# Altium schematic sheet Rotary_Encoder_Breakout_Sch.SchDoc
size A; SheetNumber: 1; SheetTotal: 1
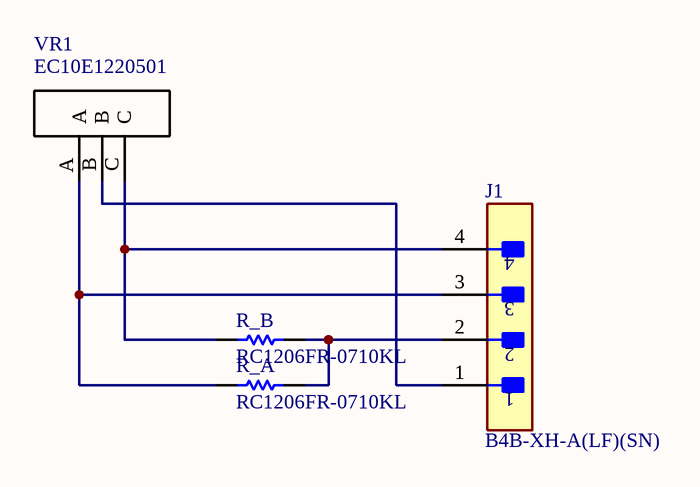
[diagram p0: Rotary_Encoder_Breakout_Sch.SchDoc]

## Parts
J1  B4B-XH-A(LF)(SN)  [FP-B4B-XH-A_LF_SN-MFG]
R_A  RC1206FR-0710KL  [RESC3116X65X40ML10T20]
R_B  RC1206FR-0710KL  [RESC3116X65X40ML10T20]
VR1  EC10E1220501  [*TRIM_EC10E1220501_EC10E1220501(Primary)]

## Nets
NetJ1_1: J1.1 VR1.B
NetJ1_2: J1.2 R_A.1 R_B.1
NetJ1_3: J1.3 R_A.2 VR1.A
NetJ1_4: J1.4 R_B.2 VR1.C

## Library data of the parts
J1 = CMP-17439-000250-1: CONN HEADER VERT 4POS 2.5MM; Number of Contacts: 4; Contact Resistance: 20mR; Voltage Rating: 250V; Max Current Rating: 3A; Gender: Male; Wire/Cable Gauge: 22AWG; Mated Stacking Heights: 9.8mm; Insulation Resistance: 1GR; Orientation: Straight; Contact Type: Male Pin; Contact Finish - Mating: TIN; Series: XH; Max Voltage Rating (AC): 250V; Lead Pitch: 2.5mm; Contact Shape: Square; Insulation Color: Natural; Termination: Solder; Lead Free: Lead Free; Voltage Rating (AC): 250V; Number of Rows: 1; Flammability Rating: UL94 V-0; Number of Positions: 4; Max Operating Temperature: 85°C; Package Quantity: 500; Mount: Through Hole; REACH SVHC: No SVHC; Connector Type: Header; Insulation Material: Nylon; Fastening Type: Detent; Min Operating Temperature: -25°C; Housing Color: White; Packaging: Bulk; Contact Plating: Tin; Contact Material: Brass; Max Voltage Rating (DC): 250V; Housing Material: Polyamide; Color: Natural; Material: Polyamide; Pitch: 2.5mm; Depth: 5.75mm; Current Rating: 3A; Length: 12.4mm
R_A R_B = CMP-1014-00623-2: Chip Resistor, 10 KOhm, +/- 1%, 0.25 W, -55 to 155 degC, 1206 (3216 Metric), RoHS, Tape and Reel; Manufacturer: Yageo; Voltage Rating: 200V; Resistance: 10KOhm; Temperature Coefficient: 100ppm/degreesC; Power Rating: 250mW; Packaging: TapeandReel; Termination: SMD/SMT; REACH SVHC: Unknown; Tolerance: 1%; Height: 0.55mm; Composition: ThickFilm; Max Operating Temperature: 155degC; Datasheet Version: Rev. 5, 10/2016; Lead Free: LeadFree; Case Code (Metric): 3216; Depth: 1.6mm; Package Quantity: 5000; RoHSCompliant: true; Military Standard: Not; Case/Package: 1206; Case Code (Imperial): 1206; Min Operating Temperature: -55degC; Datasheet URL: http://www.yageo.com/NewPortal/yageodocoutput?fileName=/pdf/R-Chip/PYu-RC_Group_51_RoHS_L_5.pdf; Length: 3.1mm; Manufacturer URL: http://www.yageo.com/; Package Reference: 1206.0; Width: 1.6mm; Package Description: 2-Pin Surface Mount Device, Body 3.1 x 1.6 mm
VR1 = EC10E1220501: Mechanical Encoder Rotary Incremental Hollow 5mN-m Right Angle Quadrature Digital Square Wave 12PPR Through Hole PC Pins; MF: ALPS; SnapEDA_Link: https://www.snapeda.com/parts/EC10E1220501/ALPS/view-part/?ref=snap; Package: None; MP: EC10E1220501; Check_prices: https://www.snapeda.com/parts/EC10E1220501/ALPS/view-part/?ref=eda; Value: *